# Altium schematic sheet BFMC_SignalDiagram.SchDoc
size A; SheetNumber: 2; SheetTotal: 8
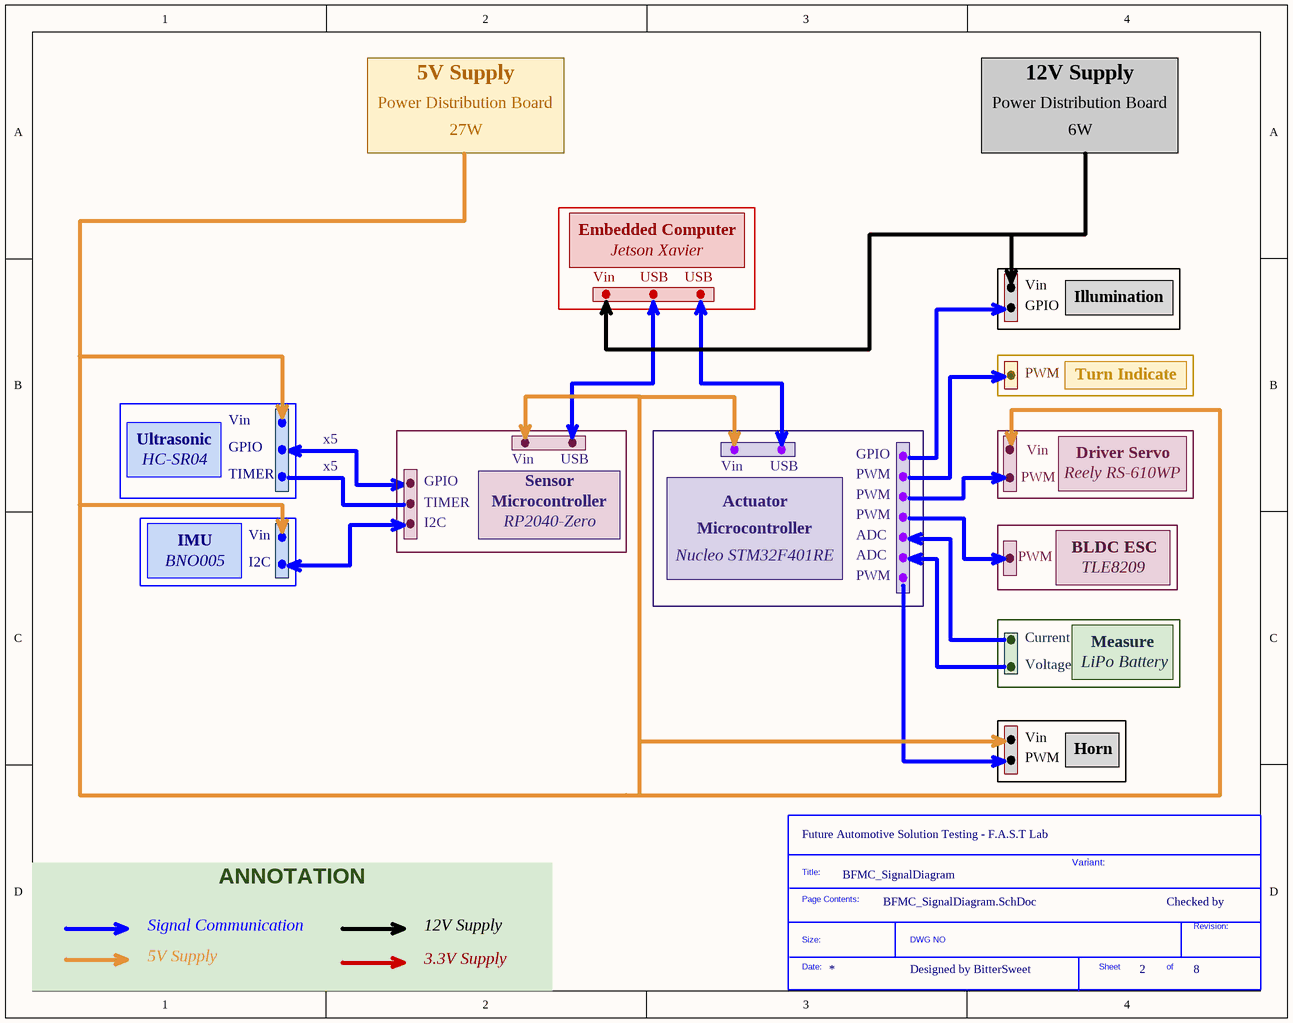
[diagram p0: BFMC_SignalDiagram.SchDoc]

## Parts
*?  SDTitleBlock  (value not drawn)  (graphical)

## Notes on the sheet
- 5V Supply
- 12V Supply
- Power Distribution Board
- 27W
- 6W
- Embedded Computer
- Vin
- Jetson Xavier
- USB
- Illumination
- GPIO
- PWM
- Turn Indicate
- Ultrasonic
- HC-SR04
- TIMER
- x5
- Microcontroller
- Sensor
- Actuator
- Reely RS-610WP
- Driver Servo
- BNO005
- IMU
- I2C
- RP2040-Zero
- Nucleo STM32F401RE
- ADC
- BLDC ESC
- TLE8209
- Current
- Voltage
- LiPo Battery
- Measure
- Horn
- (near *?) Future Automotive Solution Testing - F.A.S.T Lab
- BFMC_SignalDiagram
- Variant:
- Checked by
- Signal Communication
- 3.3V Supply
- Designed by BitterSweet
- ANNOTATION
- (in symbol SDTitleBlock) Title:; Page Contents:; Revision:; Size:; DWG NO; Date:; Sheet; of